# Altium schematic sheet Test_Points.SchDoc: Test Points
size A4; DocumentNumber: 2; SheetNumber: 2; SheetTotal: 5
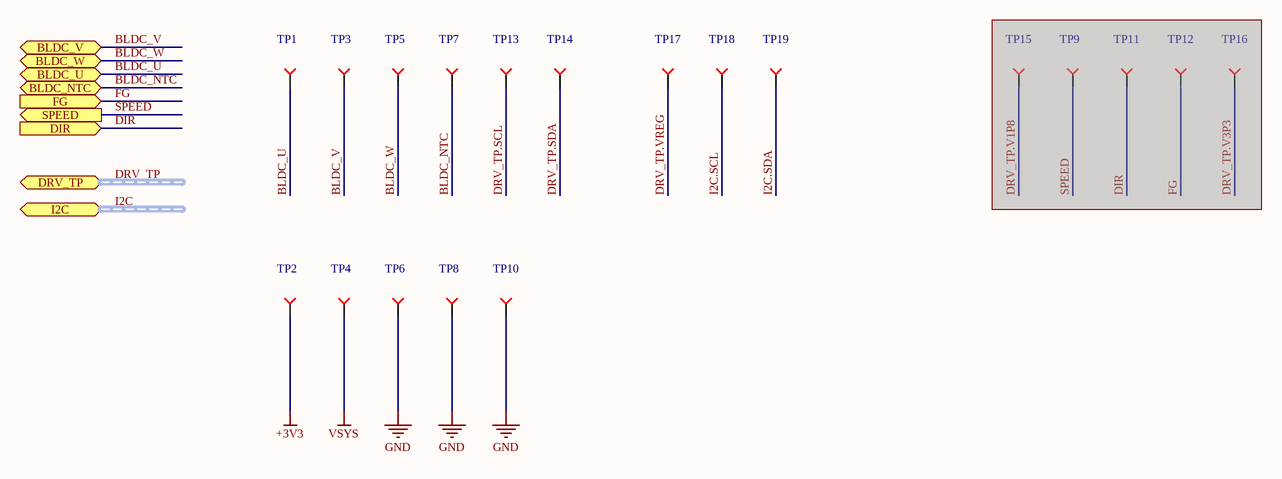
[diagram p0: Test_Points.SchDoc]

## Parts
TP1  Test Point Pad  [Testpoint]  (value not drawn)  (no BOM)
TP2  Test Point Pad  [Testpoint]  (value not drawn)  (no BOM)
TP3  Test Point Pad  [Testpoint]  (value not drawn)  (no BOM)
TP4  Test Point Pad  [Testpoint]  (value not drawn)  (no BOM)
TP5  Test Point Pad  [Testpoint]  (value not drawn)  (no BOM)
TP6  Test Point Pad  [Testpoint]  (value not drawn)  (no BOM)
TP7  Test Point Pad  [Testpoint]  (value not drawn)  (no BOM)
TP8  Test Point Pad  [Testpoint]  (value not drawn)  (no BOM)
TP9  Test Point Pad  [Testpoint]  (value not drawn)  (no BOM)  (masked out: inside a compile mask, not in the netlist)
TP10  Test Point Pad  [Testpoint]  (value not drawn)  (no BOM)
TP11  Test Point Pad  [Testpoint]  (value not drawn)  (no BOM)  (masked out: inside a compile mask, not in the netlist)
TP12  Test Point Pad  [Testpoint]  (value not drawn)  (no BOM)  (masked out: inside a compile mask, not in the netlist)
TP13  Test Point Pad  [Testpoint]  (value not drawn)  (no BOM)
TP14  Test Point Pad  [Testpoint]  (value not drawn)  (no BOM)
TP15  Test Point Pad  [Testpoint]  (value not drawn)  (no BOM)  (masked out: inside a compile mask, not in the netlist)
TP16  Test Point Pad  [Testpoint]  (value not drawn)  (no BOM)  (masked out: inside a compile mask, not in the netlist)
TP17  Test Point Pad  [Testpoint]  (value not drawn)  (no BOM)
TP18  Test Point Pad  [Testpoint]  (value not drawn)  (no BOM)
TP19  Test Point Pad  [Testpoint]  (value not drawn)  (no BOM)

## Ports
BLDC_NTC, BLDC_U, BLDC_V, BLDC_W, DIR (in), DRV_TP (harness DRV10975_TP), FG (in), I2C (harness I2C), SPEED (out)

## Nets
+3V3: TP2.1
GND: TP6.1 TP8.1 TP10.1
VSYS: TP4.1
BLDC_NTC: TP7.1 ; port BLDC_NTC
BLDC_U: TP1.1 ; port BLDC_U
BLDC_V: TP3.1 ; port BLDC_V
BLDC_W: TP5.1 ; port BLDC_W
DIR: port DIR
DRV_TP.SCL: TP13.1
DRV_TP.SDA: TP14.1
DRV_TP.VREG: TP17.1
FG: port FG
I2C.SCL: TP18.1
I2C.SDA: TP19.1
SPEED: port SPEED

## Buses and harness runs
harness DRV_TP = port DRV_TP
harness I2C = port I2C

## Notes on the sheet
- Title
- Size:
- Date:
- A4
- Number:
- Time:
- Revision:
- Sheet
- of
- File:

## Library data of the parts
TP1-TP19 = Test Point Pad: Test Point. There is nothing to buy or mount.; ClassName: TestPoint; CompType: TestPoint; Manufacturer: N/A; MountType: N/A; PackageReference: TetsPoint; PartNumber: N/A